# EAGLE schematic LazuriteGateway (EAGLE 7.6.0)
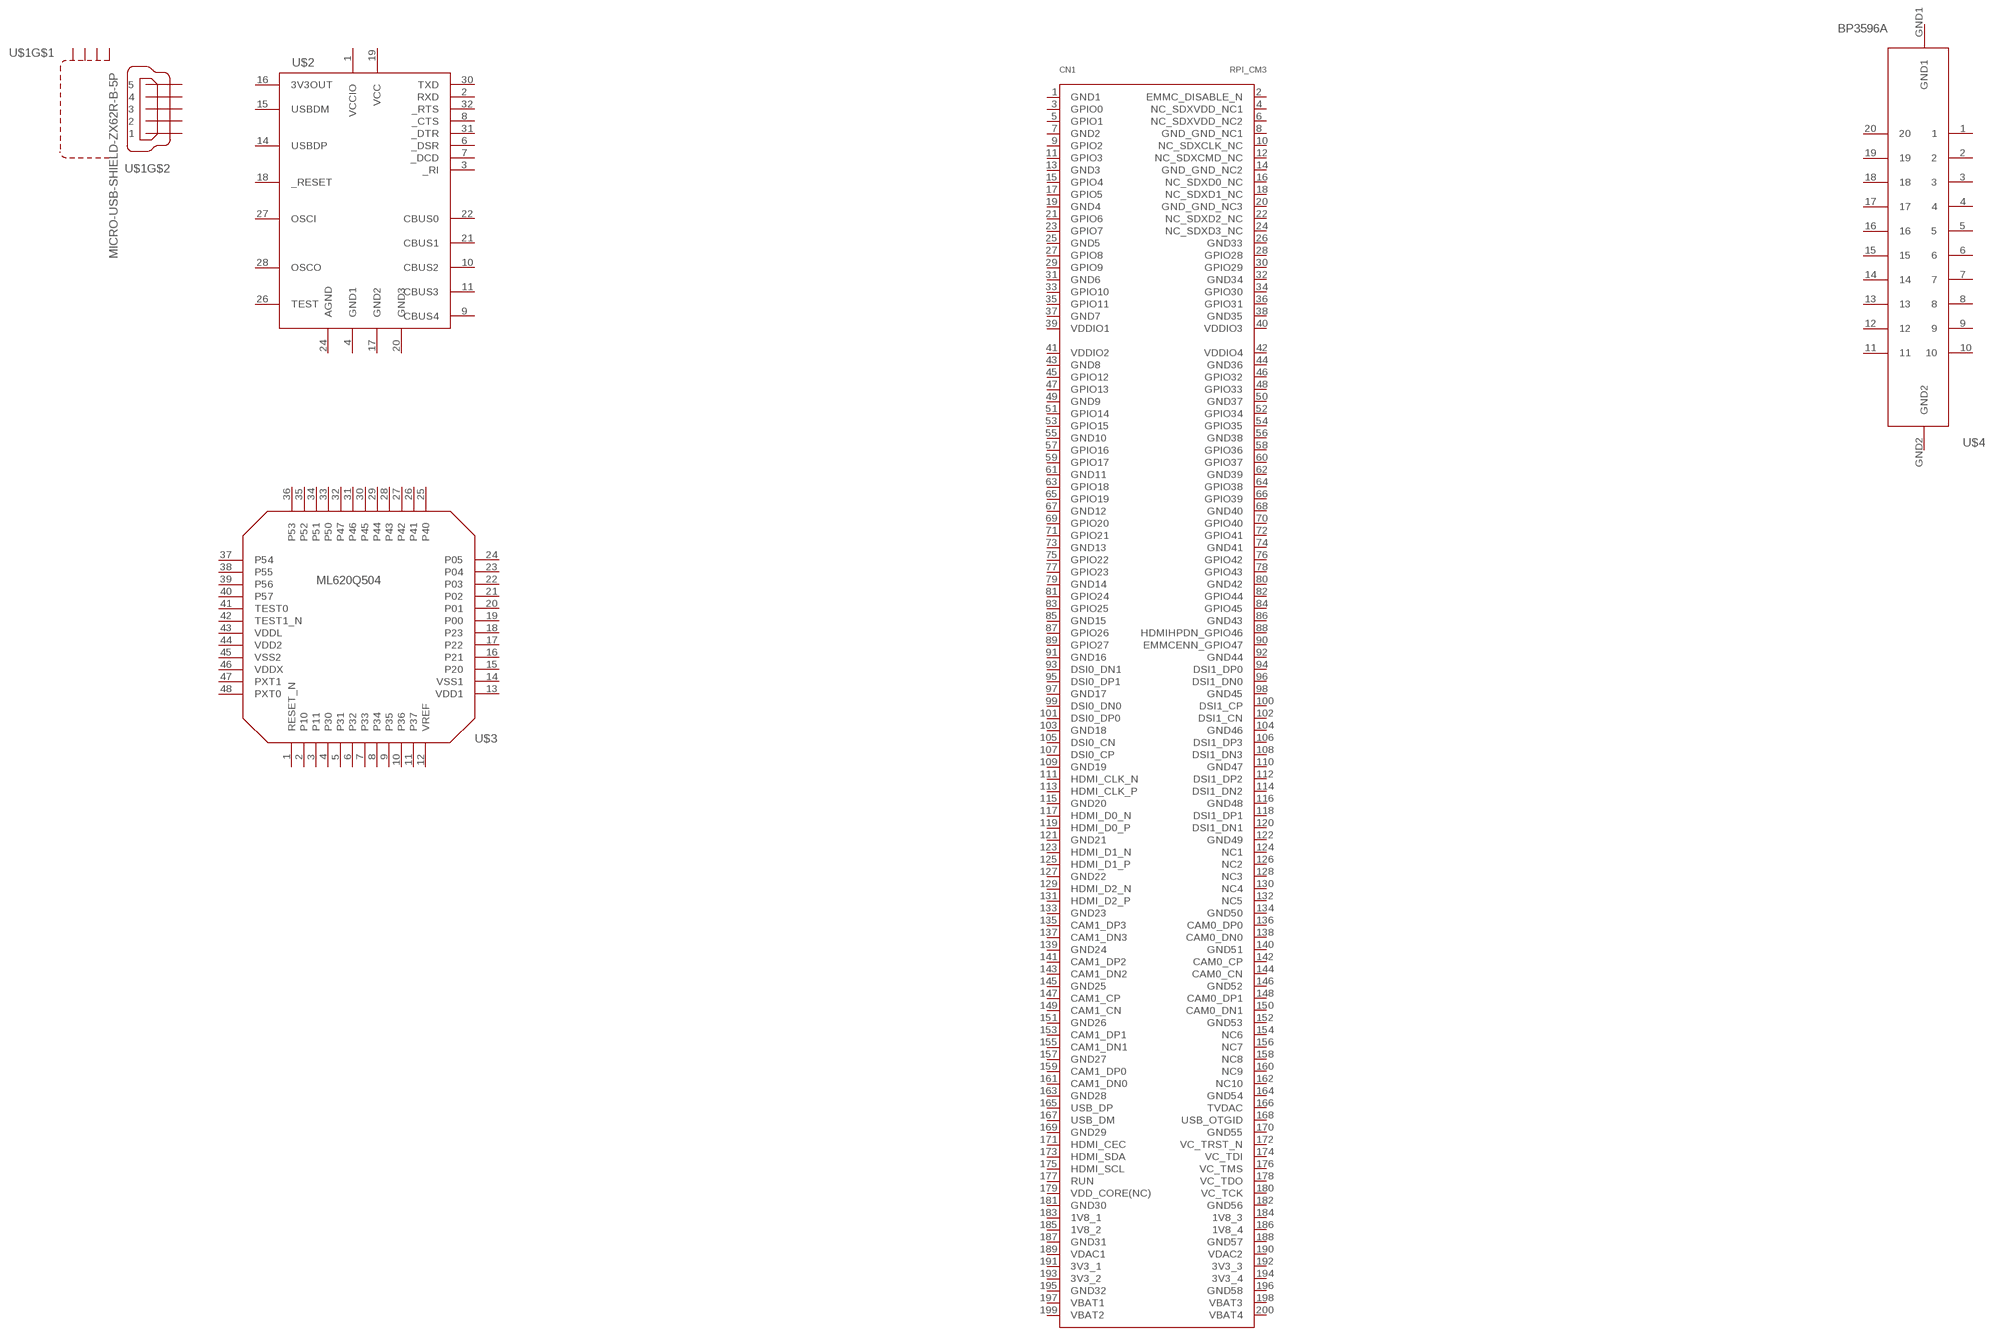
[diagram p0: schematic, sheet 1]

## Parts
CN1  RPI_CM3  [DIMMSO_200PIN]
U$1  MICRO-USB-SHIELD-ZX62R-B-5P  [ZX62R-B-5P]
U$2  FT232RQ  [MLF32]
U$3  ML620Q504  [ML620Q504]
U$4  BP3596A  [BP3596A]
Unconnected: CN1.1(GND1) CN1.2(EMMC_DISABLE_N) CN1.3(GPIO0) CN1.4(NC_SDXVDD_NC1) CN1.5(GPIO1) CN1.6(NC_SDXVDD_NC2) CN1.7(GND2) CN1.8(GND_GND_NC1) CN1.9(GPIO2) CN1.10(NC_SDXCLK_NC) CN1.11(GPIO3) CN1.12(NC_SDXCMD_NC) CN1.13(GND3) CN1.14(GND_GND_NC2) CN1.15(GPIO4) CN1.16(NC_SDXD0_NC) CN1.17(GPIO5) CN1.18(NC_SDXD1_NC) CN1.19(GND4) CN1.20(GND_GND_NC3) CN1.21(GPIO6) CN1.22(NC_SDXD2_NC) CN1.23(GPIO7) CN1.24(NC_SDXD3_NC) CN1.25(GND5) CN1.26(GND33) CN1.27(GPIO8) CN1.28(GPIO28) CN1.29(GPIO9) CN1.30(GPIO29) CN1.31(GND6) CN1.32(GND34) CN1.33(GPIO10) CN1.34(GPIO30) CN1.35(GPIO11) CN1.36(GPIO31) CN1.37(GND7) CN1.38(GND35) CN1.39(VDDIO1) CN1.40(VDDIO3) CN1.41(VDDIO2) CN1.42(VDDIO4) CN1.43(GND8) CN1.44(GND36) CN1.45(GPIO12) CN1.46(GPIO32) CN1.47(GPIO13) CN1.48(GPIO33) CN1.49(GND9) CN1.50(GND37) CN1.51(GPIO14) CN1.52(GPIO34) CN1.53(GPIO15) CN1.54(GPIO35) CN1.55(GND10) CN1.56(GND38) CN1.57(GPIO16) CN1.58(GPIO36) CN1.59(GPIO17) CN1.60(GPIO37) CN1.61(GND11) CN1.62(GND39) CN1.63(GPIO18) CN1.64(GPIO38) CN1.65(GPIO19) CN1.66(GPIO39) CN1.67(GND12) CN1.68(GND40) CN1.69(GPIO20) CN1.70(GPIO40) CN1.71(GPIO21) CN1.72(GPIO41) CN1.73(GND13) CN1.74(GND41) CN1.75(GPIO22) CN1.76(GPIO42) CN1.77(GPIO23) CN1.78(GPIO43) CN1.79(GND14) CN1.80(GND42) CN1.81(GPIO24) CN1.82(GPIO44) CN1.83(GPIO25) CN1.84(GPIO45) CN1.85(GND15) CN1.86(GND43) CN1.87(GPIO26) CN1.88(HDMIHPDN_GPIO46) CN1.89(GPIO27) CN1.90(EMMCENN_GPIO47) CN1.91(GND16) CN1.92(GND44) CN1.93(DSI0_DN1) CN1.94(DSI1_DP0) CN1.95(DSI0_DP1) CN1.96(DSI1_DN0) CN1.97(GND17) CN1.98(GND45) CN1.99(DSI0_DN0) CN1.100(DSI1_CP) CN1.101(DSI0_DP0) CN1.102(DSI1_CN) CN1.103(GND18) CN1.104(GND46) CN1.105(DSI0_CN) CN1.106(DSI1_DP3) CN1.107(DSI0_CP) CN1.108(DSI1_DN3) CN1.109(GND19) CN1.110(GND47) CN1.111(HDMI_CLK_N) CN1.112(DSI1_DP2) CN1.113(HDMI_CLK_P) CN1.114(DSI1_DN2) CN1.115(GND20) CN1.116(GND48) CN1.117(HDMI_D0_N) CN1.118(DSI1_DP1) CN1.119(HDMI_D0_P) CN1.120(DSI1_DN1) CN1.121(GND21) CN1.122(GND49) CN1.123(HDMI_D1_N) CN1.124(NC1) CN1.125(HDMI_D1_P) CN1.126(NC2) CN1.127(GND22) CN1.128(NC3) CN1.129(HDMI_D2_N) CN1.130(NC4) CN1.131(HDMI_D2_P) CN1.132(NC5) CN1.133(GND23) CN1.134(GND50) CN1.135(CAM1_DP3) CN1.136(CAM0_DP0) CN1.137(CAM1_DN3) CN1.138(CAM0_DN0) CN1.139(GND24) CN1.140(GND51) CN1.141(CAM1_DP2) CN1.142(CAM0_CP) CN1.143(CAM1_DN2) CN1.144(CAM0_CN) CN1.145(GND25) CN1.146(GND52) CN1.147(CAM1_CP) CN1.148(CAM0_DP1) CN1.149(CAM1_CN) CN1.150(CAM0_DN1) CN1.151(GND26) CN1.152(GND53) CN1.153(CAM1_DP1) CN1.154(NC6) CN1.155(CAM1_DN1) CN1.156(NC7) CN1.157(GND27) CN1.158(NC8) CN1.159(CAM1_DP0) CN1.160(NC9) CN1.161(CAM1_DN0) CN1.162(NC10) CN1.163(GND28) CN1.164(GND54) CN1.165(USB_DP) CN1.166(TVDAC) CN1.167(USB_DM) CN1.168(USB_OTGID) CN1.169(GND29) CN1.170(GND55) CN1.171(HDMI_CEC) CN1.172(VC_TRST_N) CN1.173(HDMI_SDA) CN1.174(VC_TDI) CN1.175(HDMI_SCL) CN1.176(VC_TMS) CN1.177(RUN) CN1.178(VC_TDO) CN1.179(VDD_CORE(NC)) CN1.180(VC_TCK) CN1.181(GND30) CN1.182(GND56) CN1.183(1V8_1) CN1.184(1V8_3) CN1.185(1V8_2) CN1.186(1V8_4) CN1.187(GND31) CN1.188(GND57) CN1.189(VDAC1) CN1.190(VDAC2) CN1.191(3V3_1) CN1.192(3V3_3) CN1.193(3V3_2) CN1.194(3V3_4) CN1.195(GND32) CN1.196(GND58) CN1.197(VBAT1) CN1.198(VBAT3) CN1.199(VBAT2) CN1.200(VBAT4) U$1.1 U$1.2 U$1.3 U$1.4 U$1.5 U$1.M1(S1) U$1.M2(S2) U$1.M3(S3) U$1.M4(S4) U$2.2(RXD) U$2.3(_RI) U$2.6(_DSR) U$2.7(_DCD) U$2.8(_CTS) U$2.9(CBUS4) U$2.10(CBUS2) U$2.11(CBUS3) U$2.14(USBDP) U$2.15(USBDM) U$2.16(3V3OUT) U$2.18(_RESET) U$2.21(CBUS1) U$2.22(CBUS0) U$2.26(TEST) U$2.27(OSCI) U$2.28(OSCO) U$2.30(TXD) U$2.31(_DTR) U$2.32(_RTS) U$3.1(RESET_N) U$3.2(P10) U$3.3(P11) U$3.4(P30) U$3.5(P31) U$3.6(P32) U$3.7(P33) U$3.8(P34) U$3.9(P35) U$3.10(P36) U$3.11(P37) U$3.12(VREF) U$3.13(VDD1) U$3.14(VSS1) U$3.15(P20) U$3.16(P21) U$3.17(P22) U$3.18(P23) U$3.19(P00) U$3.20(P01) U$3.21(P02) U$3.22(P03) U$3.23(P04) U$3.24(P05) U$3.25(P40) U$3.26(P41) U$3.27(P42) U$3.28(P43) U$3.29(P44) U$3.30(P45) U$3.31(P46) U$3.32(P47) U$3.33(P50) U$3.34(P51) U$3.35(P52) U$3.36(P53) U$3.37(P54) U$3.38(P55) U$3.39(P56) U$3.40(P57) U$3.41(TEST0) U$3.42(TEST1_N) U$3.43(VDDL) U$3.44(VDD2) U$3.45(VSS2) U$3.46(VDDX) U$3.47(PXT1) U$3.48(PXT0) U$4.1 U$4.2 U$4.3 U$4.4 U$4.5 U$4.6 U$4.7 U$4.8 U$4.9 U$4.10 U$4.11 U$4.12 U$4.13 U$4.14 U$4.15 U$4.16 U$4.17 U$4.18 U$4.19 U$4.20 U$4.GND1 U$4.GND2

## Power pins joined to a net without a drawn wire
AGND: U$2.24(AGND)
GND1: U$2.4(GND1)
GND2: U$2.17(GND2)
GND3: U$2.20(GND3)
VCC: U$2.19(VCC)
VCCIO: U$2.1(VCCIO)

## Library data of the parts
CN1 = mouser:RPI_CM3
U$1 = con-hirose:MICRO-USB-SHIELD-: Hirose Micro USB Connector ZX62R-B-5P: Micro B, reverse (top mount) shell SMT Supplier: DigiKey H11574CT-ND Source: http://www.hirose.co.jp/cataloge_hp/e24200011.pdf
U$2 = ftdichip-1:FT232RQ: USB UART 4th Generation USB UART (USB <-> Serial) Controller
U$3 = lazurite:ML620Q504
U$4 = lazurite:BP3596A